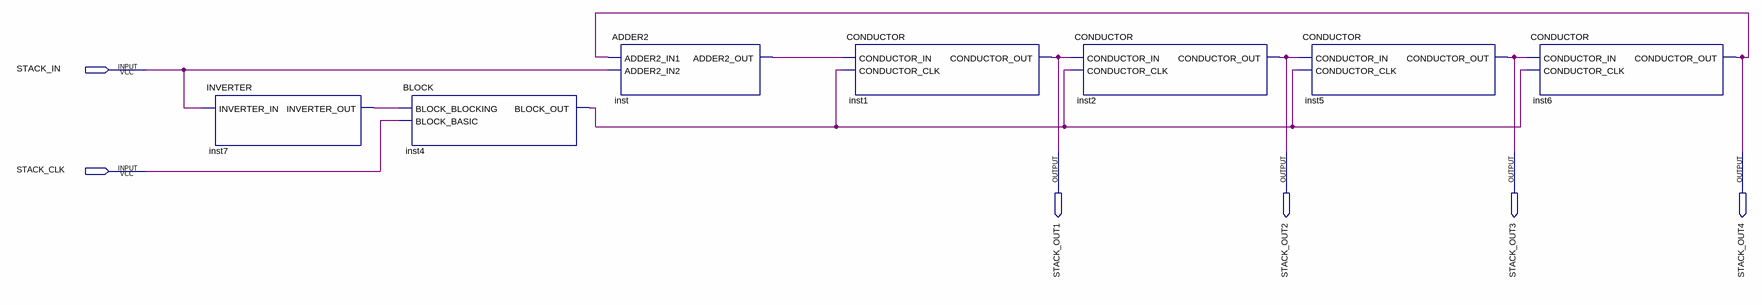
[diagram p0: schematic sheet]
// Quartus schematic STACK.bdf as structural Verilog: 7 symbols, 6 pins
module STACK (
  input  STACK_IN,
  input  STACK_CLK,
  output STACK_OUT1,
  output STACK_OUT2,
  output STACK_OUT3,
  output STACK_OUT4
);

  wire inst4_block_out, inst7_inverter_out, inst_adder2_out;

  INVERTER inst7 (.INVERTER_IN(STACK_IN), .INVERTER_OUT(inst7_inverter_out));
  BLOCK inst4 (.BLOCK_BLOCKING(inst7_inverter_out), .BLOCK_BASIC(STACK_CLK), .BLOCK_OUT(inst4_block_out));
  ADDER2 inst (.ADDER2_IN1(STACK_OUT4), .ADDER2_IN2(STACK_IN), .ADDER2_OUT(inst_adder2_out));
  CONDUCTOR inst1 (.CONDUCTOR_IN(inst_adder2_out), .CONDUCTOR_CLK(inst4_block_out), .CONDUCTOR_OUT(STACK_OUT1));
  CONDUCTOR inst2 (.CONDUCTOR_IN(STACK_OUT1), .CONDUCTOR_CLK(inst4_block_out), .CONDUCTOR_OUT(STACK_OUT2));
  CONDUCTOR inst5 (.CONDUCTOR_IN(STACK_OUT2), .CONDUCTOR_CLK(inst4_block_out), .CONDUCTOR_OUT(STACK_OUT3));
  CONDUCTOR inst6 (.CONDUCTOR_IN(STACK_OUT3), .CONDUCTOR_CLK(inst4_block_out), .CONDUCTOR_OUT(STACK_OUT4));
endmodule
